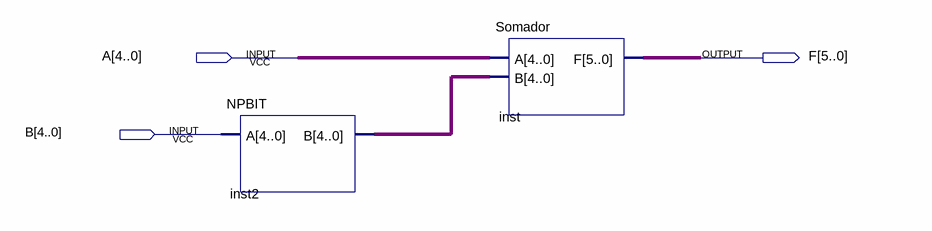
[diagram p0: schematic sheet]
// Quartus schematic Subtrator.bdf as structural Verilog: 2 symbols, 3 pins
module Subtrator (
  input  [4:0] A,
  input  [4:0] B,
  output [5:0] F
);

  wire [4:0] inst2_b;

  NPBIT inst2 (.A(B), .B(inst2_b));
  Somador inst (.A(A), .B(inst2_b), .F(F));
endmodule
